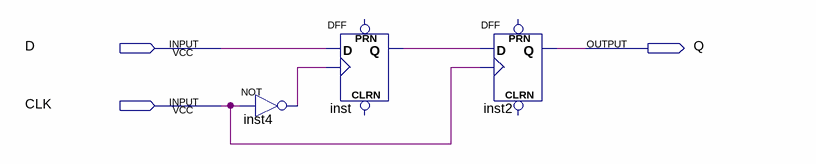
[diagram p0: schematic sheet]
// Quartus schematic step_2.bdf as structural Verilog: 3 symbols, 3 pins
module step_2 (
  input  D,
  input  CLK,
  output Q
);

  wire inst4_out, inst_q;

  not inst4 (inst4_out, CLK);
  DFF inst (.CLK(inst4_out), .D(D), .Q(inst_q));  // open: CLRN, PRN
  DFF inst2 (.CLK(CLK), .D(inst_q), .Q(Q));  // open: CLRN, PRN
endmodule
